# EAGLE schematic Adapter-Stamps-001 (EAGLE 7.3.0)
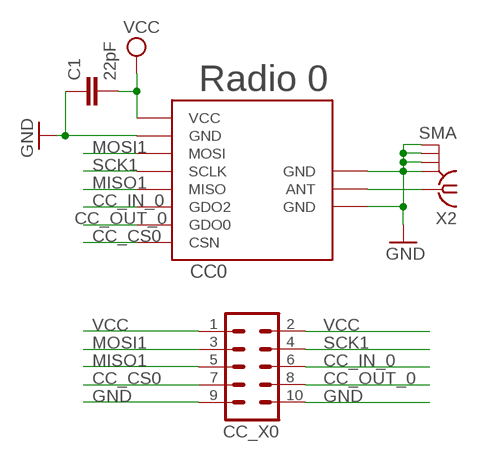
[diagram p0: schematic, sheet 1]

## Parts
C1  22pF  C-EUC0805  [C0805]
CC0  CC1101_MODULE1SMD  [CC1101_MODULE1_SMD]
CC_X0  MA05-2  [MA05-2]
X2  SMA  [SMA]

## Nets
CC_CS0: CC0.CSN CC_X0.7
CC_IN_0: CC0.GDO2 CC_X0.6
CC_OUT_0: CC0.GDO0 CC_X0.8
GND: C1.1 CC0.GND@0(GND) CC0.GND@1(GND) CC0.GND@2(GND) CC_X0.9 CC_X0.10 X2.GND@1 X2.GND@2 X2.GND@3 X2.GND@4
MISO1: CC0.MISO CC_X0.5
MOSI1: CC0.MOSI CC_X0.3
N$4: CC0.ANT X2.1
SCK1: CC0.SCLK CC_X0.4
VCC: C1.2 CC0.VCC CC_X0.1 CC_X0.2

## Notes on the sheet
- Radio 0

## Library data of the parts
C1 = rcl:C-EU: CAPACITOR, European symbol
CC0 = wireless:CC1101_MODULE1: CC1101 wireless module for 433/868 MHz (sold from Aliexpress). DIL version for mounting with pin header (and SMD soldering) and SMD only variant available.
CC_X0 = con-lstb:MA05-2: PIN HEADER; OC_FARNELL: unknown; OC_NEWARK: unknown
X2 = sma:SMA: SMA 50 Ohm end launch jack receptacle - round contact

## Net classes
0 default: width 0.406 mm
1 PWR: width 0.305 mm